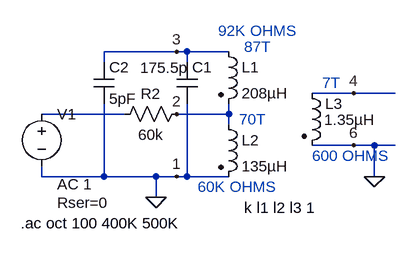
[diagram p0: schematic IF_CAN.asc]
IF_CAN.asc, the LTspice schematic file:
Version 4
SHEET 1 880 680
WIRE 112 48 0 48
WIRE 128 48 112 48
WIRE 192 48 128 48
WIRE 0 64 0 48
WIRE 128 64 128 48
WIRE 384 112 320 112
WIRE 448 112 384 112
WIRE 32 144 -96 144
WIRE 192 144 192 128
WIRE 192 144 112 144
WIRE 192 160 192 144
WIRE 384 192 320 192
WIRE 416 192 384 192
WIRE 448 192 416 192
WIRE -96 240 -96 224
WIRE 0 240 0 128
WIRE 0 240 -96 240
WIRE 80 240 0 240
WIRE 112 240 80 240
WIRE 128 240 128 128
WIRE 128 240 112 240
WIRE 192 240 128 240
WIRE 416 240 416 192
WIRE 80 272 80 240
FLAG 112 48 3
FLAG 112 144 2
FLAG 112 240 1
FLAG 384 112 4
FLAG 384 192 6
FLAG 80 272 0
FLAG 416 240 0
SYMBOL ind2 176 32 R0
SYMATTR InstName L1
SYMATTR Value 208µH
SYMATTR Type ind
SYMBOL ind2 176 144 R0
SYMATTR InstName L2
SYMATTR Value 135µH
SYMATTR Type ind
SYMBOL ind2 304 96 R0
WINDOW 0 36 32 Left 2
WINDOW 3 35 57 Left 2
SYMATTR InstName L3
SYMATTR Value 1.35µH
SYMATTR Type ind
SYMBOL cap 112 64 R0
WINDOW 3 -56 9 Left 2
SYMATTR Value 175.5p
SYMATTR InstName C1
SYMBOL voltage -96 128 R0
WINDOW 123 24 124 Left 2
WINDOW 39 24 152 Left 2
SYMATTR Value2 AC 1
SYMATTR SpiceLine Rser=0
SYMATTR InstName V1
SYMATTR Value ""
SYMBOL cap -16 64 R0
SYMATTR InstName C2
SYMATTR Value 5pF
SYMBOL res 128 128 R90
WINDOW 0 0 56 VBottom 2
WINDOW 3 32 56 VTop 2
SYMATTR InstName R2
SYMATTR Value 60k
TEXT 216 288 Left 2 !k l1 l2 l3 1
TEXT 216 40 Left 2 ;87T
TEXT 208 152 Left 2 ;70T
TEXT 336 96 Left 2 ;7T
TEXT 320 208 Left 2 ;600 OHMS
TEXT 144 256 Left 2 ;60K OHMS
TEXT 176 16 Left 2 ;92K OHMS
TEXT -128 312 Left 2 !.ac oct 100 400K 500K

The netlist it stands for:
* IF_CAN.asc
L1 3 2 208µH
L2 2 0 135µH
L3 4 0 1.35µH
C1 3 0 175.5p
V1 N001 0 AC 1 Rser=0
C2 3 0 5pF
R2 2 N001 60k
k l1 l2 l3 1
* 87T
* 70T
* 7T
* 600 OHMS
* 60K OHMS
* 92K OHMS
.ac oct 100 400K 500K
.backanno
.end